# EAGLE design 27128_27256_Multi-ROM_Rev_4 (EAGLE 9.7.0)
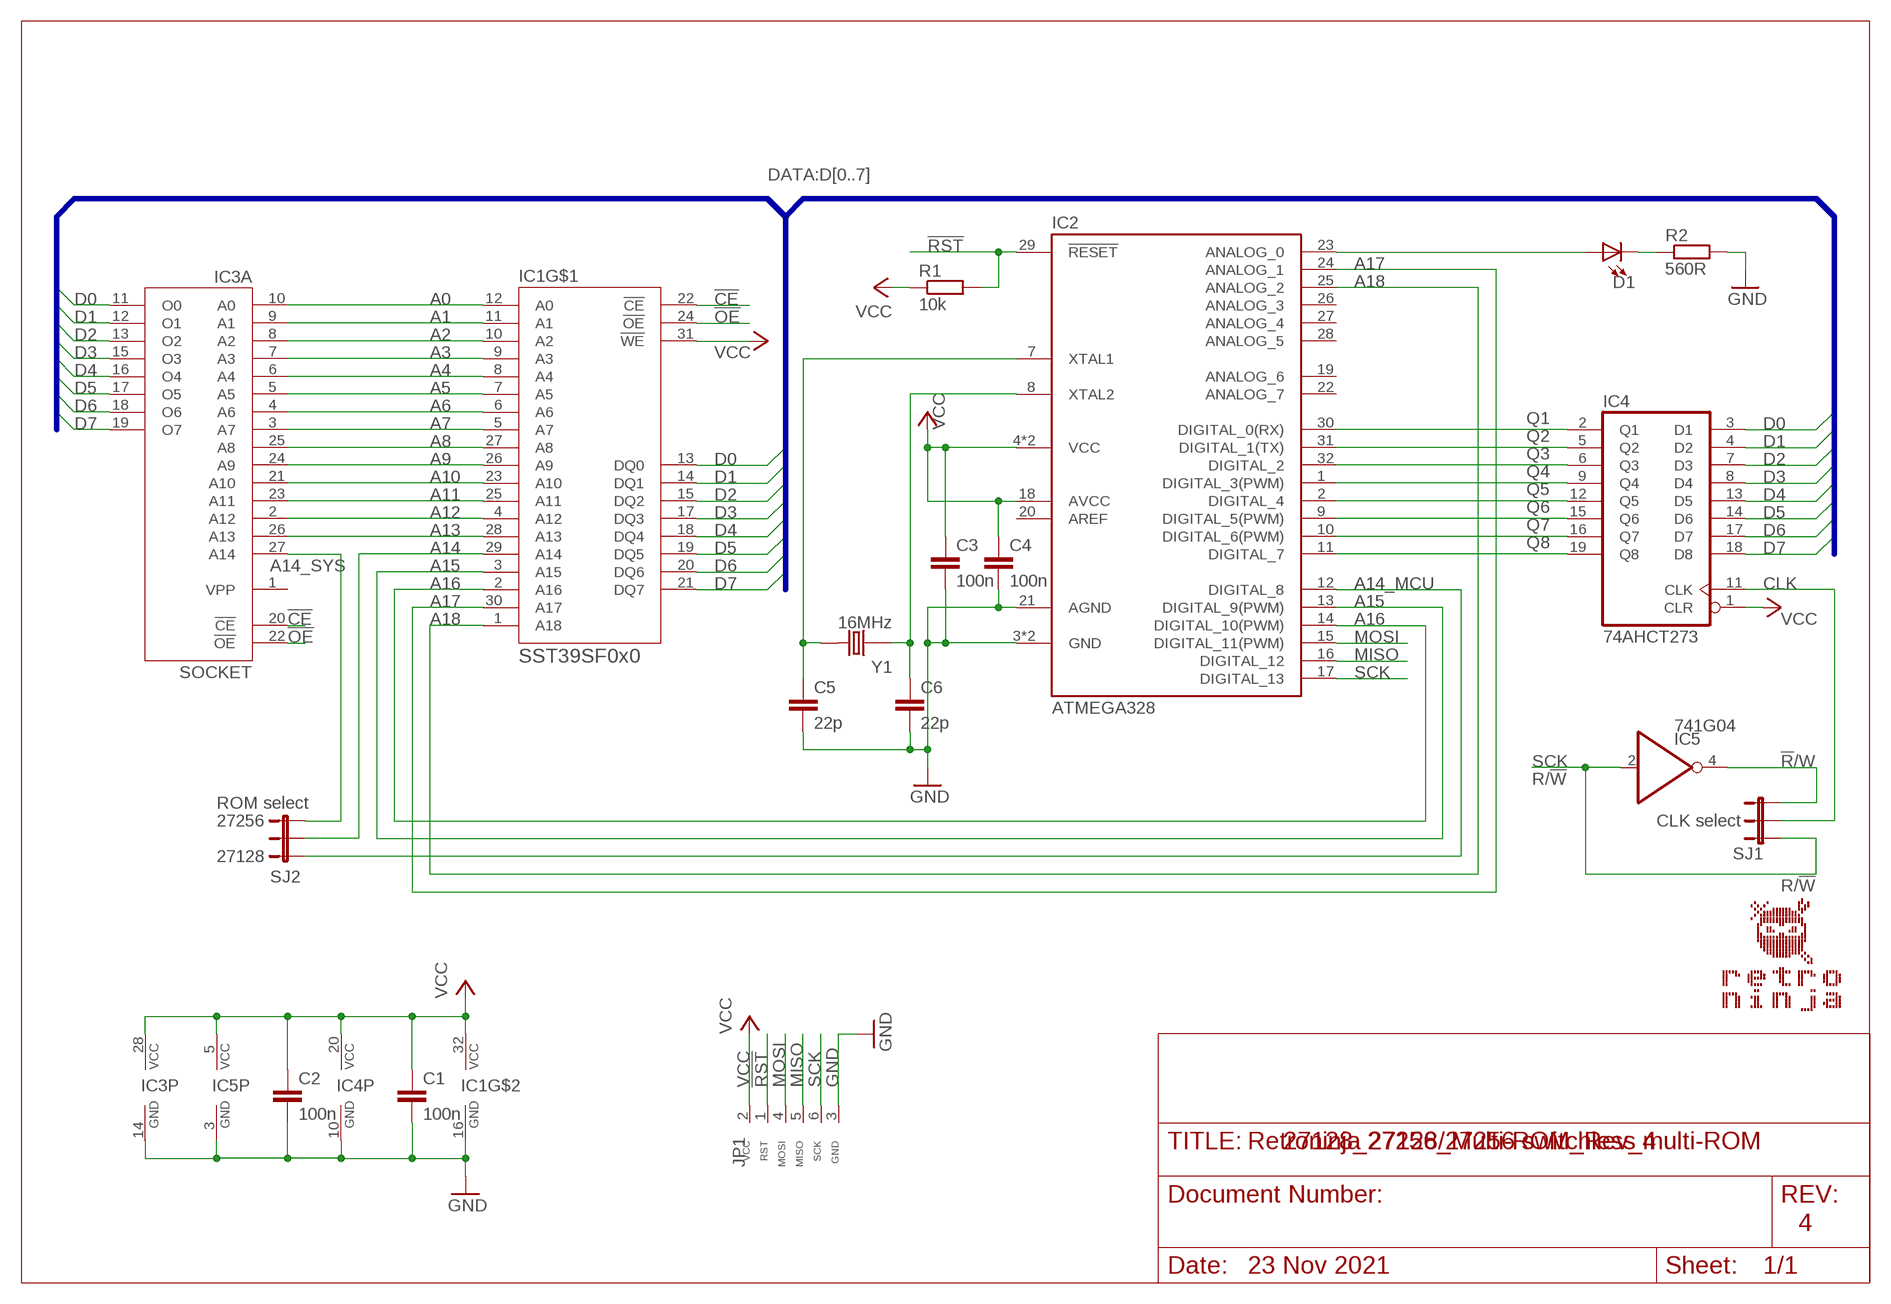
[diagram p0: schematic, sheet 1]

## Parts
C1  100n  C-EUC0805  [C0805]
C2  100n  C-EUC0805  [C0805]
C3  100n  C-EUC0805  [C0805]
C4  100n  C-EUC0805  [C0805]
C5  22p  C-EUC0805  [C0805]
C6  22p  C-EUC0805  [C0805]
D1  LED_0805  [LED0805]
IC1  SST39SF0x0  SST39XX040_PLCC_SHORT  [PLCC32_SHORT]
IC2  ATMEGA328  ARDUINO_168_328_TQFP  [TQFP32]
IC3  SOCKET  27C256_DOWNPINS  [DIL28-6_DOWNPINS]
IC4  74AHCT273  74273NS  [SO20]
IC5  741G04  741G04_SOT23  [SOT23-5]
JP1  ICSP_CONNECTOR_TL866_RIGHT2  [HEADER_1X6_RIGHT]
R1  10k  R-EU_R0805  [R0805]
R2  560R  R-EU_R0805  [R0805]
SJ1  JUMPER-3SJ  [SJ-3]
SJ2  JUMPER-3SJ  [SJ-3]
Y1  16MHz  CRYSTAL  [CRYSTAL_SMD-2_7X4X2.3]

## Nets
!CE: IC1.22(!CE) IC3.20(A:!CE)
!OE: IC1.24(!OE) IC3.22(A:!OE)
!R!/W: IC5.4(O) SJ1.3
!RST: IC2.29(!RESET) JP1.1(RST) R1.2
A0: IC1.12(A0) IC3.10(A:A0)
A1: IC1.11(A1) IC3.9(A:A1)
A2: IC1.10(A2) IC3.8(A:A2)
A3: IC1.9(A3) IC3.7(A:A3)
A4: IC1.8(A4) IC3.6(A:A4)
A5: IC1.7(A5) IC3.5(A:A5)
A6: IC1.6(A6) IC3.4(A:A6)
A7: IC1.5(A7) IC3.3(A:A7)
A8: IC1.27(A8) IC3.25(A:A8)
A9: IC1.26(A9) IC3.24(A:A9)
A10: IC1.23(A10) IC3.21(A:A10)
A11: IC1.25(A11) IC3.23(A:A11)
A12: IC1.4(A12) IC3.2(A:A12)
A13: IC1.28(A13) IC3.26(A:A13)
A14: IC1.29(A14) SJ2.2
A14_MCU: IC2.12(DIGITAL_8) SJ2.1
A14_SYS: IC3.27(A:A14) SJ2.3
A15: IC1.3(A15) IC2.13(DIGITAL_9(PWM))
A16: IC1.2(A16) IC2.14(DIGITAL_10(PWM))
A17: IC1.30(A17) IC2.24(ANALOG_1)
A18: IC1.1(A18) IC2.25(ANALOG_2)
CLK: IC4.11(CLK) SJ1.2
D0: IC1.13(DQ0) IC3.11(A:O0) IC4.3(D1)
D1: IC1.14(DQ1) IC3.12(A:O1) IC4.4(D2)
D2: IC1.15(DQ2) IC3.13(A:O2) IC4.7(D3)
D3: IC1.17(DQ3) IC3.15(A:O3) IC4.8(D4)
D4: IC1.18(DQ4) IC3.16(A:O4) IC4.13(D5)
D5: IC1.19(DQ5) IC3.17(A:O5) IC4.14(D6)
D6: IC1.20(DQ6) IC3.18(A:O6) IC4.17(D7)
D7: IC1.21(DQ7) IC3.19(A:O7) IC4.18(D8)
GND: C1.2 C2.2 C3.2 C4.2 C5.2 C6.2 IC1.16(GND) IC2.3(GND) IC2.5(GND) IC2.21(AGND) IC3.14(P:GND) IC4.10(GND) IC5.3(GND) JP1.3(GND) R2.2
MISO: IC2.16(DIGITAL_12) JP1.5(MISO)
MOSI: IC2.15(DIGITAL_11(PWM)) JP1.4(MOSI)
N$16: C6.1 IC2.8(XTAL2) Y1.1
N$17: C5.1 IC2.7(XTAL1) Y1.2
N$25: D1.A IC2.23(ANALOG_0)
N$26: D1.C R2.1
Q1: IC2.30(DIGITAL_0(RX)) IC4.2(Q1)
Q2: IC2.31(DIGITAL_1(TX)) IC4.5(Q2)
Q3: IC2.32(DIGITAL_2) IC4.6(Q3)
Q4: IC2.1(DIGITAL_3(PWM)) IC4.9(Q4)
Q5: IC2.2(DIGITAL_4) IC4.12(Q5)
Q6: IC2.9(DIGITAL_5(PWM)) IC4.15(Q6)
Q7: IC2.10(DIGITAL_6(PWM)) IC4.16(Q7)
Q8: IC2.11(DIGITAL_7) IC4.19(Q8)
SCK: IC2.17(DIGITAL_13) IC5.2(I) JP1.6(SCK) SJ1.1
VCC: C1.1 C2.1 C3.1 C4.1 IC1.31(!WE) IC1.32(VCC) IC2.4(VCC) IC2.6(VCC) IC2.18(AVCC) IC3.28(P:VCC) IC4.1(CLR) IC4.20(VCC) IC5.5(VCC) JP1.2(VCC) R1.1
Unconnected: IC2.19(ANALOG_6) IC2.20(AREF) IC2.22(ANALOG_7) IC2.26(ANALOG_3) IC2.27(ANALOG_4) IC2.28(ANALOG_5)

## Buses
DATA:D[0..7]

## Notes on the sheet
- R/!W
- ROM select
- 27256 | CLK select
- 27128
- R/!W
- Retroninja 27128/27256 switchless multi-ROM
- 4
- 23 Nov 2021

## Power pins joined to a net without a drawn wire
VPP: IC3.1(A:VPP)

## Library data of the parts
C1-C6 = rcl:C-EU: CAPACITOR, European symbol; SPICEPREFIX: C
D1 = Per (Fusion 360):LED
IC1 = Per (Fusion 360):SST39XX040
IC2 = Per (Fusion 360):ARDUINO_168_328
IC3 = Per (Fusion 360):27C256
IC4 = Per (Fusion 360):74*273
IC5 = Per (Fusion 360):74*1G04
JP1 = Per (Fusion 360):ICSP_CONNECTOR: PIN HEADER
R1 R2 = rcl:R-EU_: RESISTOR, European symbol; SPICEPREFIX: R
SJ1 SJ2 = Per (Fusion 360):JUMPER-3
Y1 = Per (Fusion 360):CRYSTAL

## Board
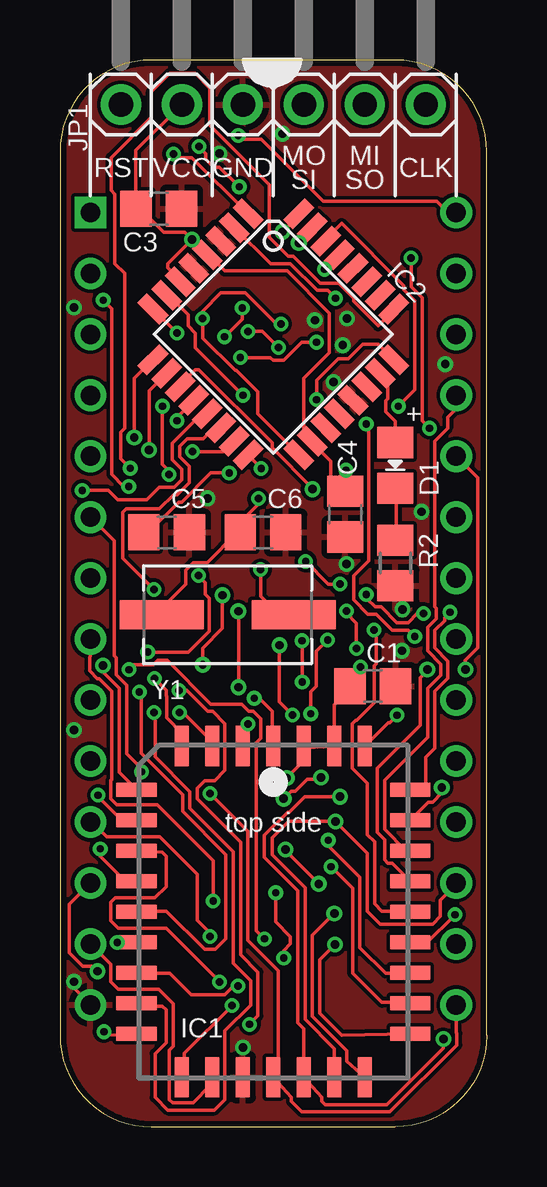
[diagram p1: board, top side]
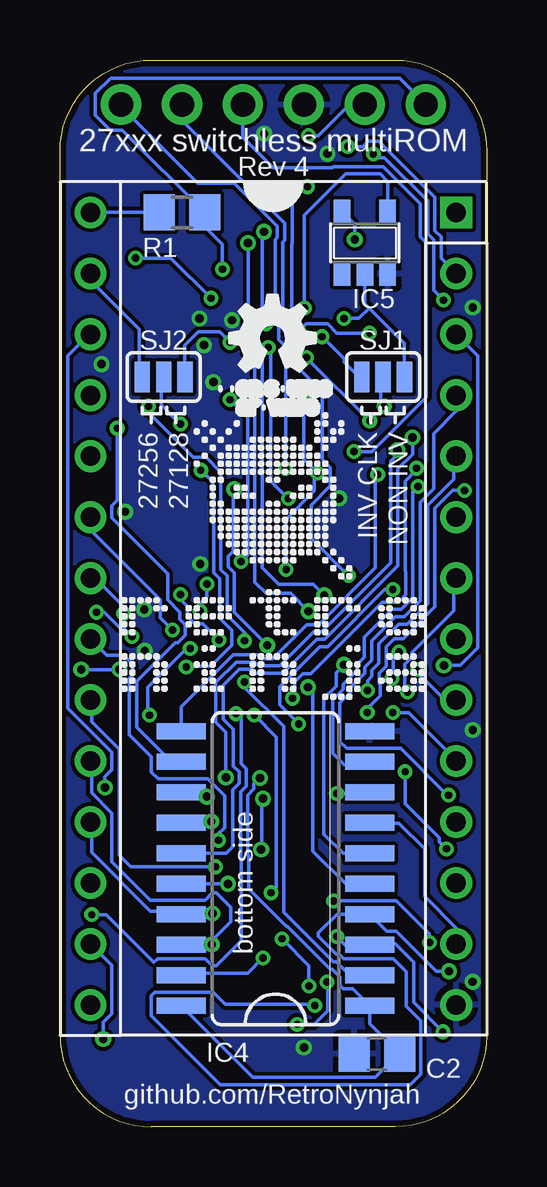
[diagram p2: board, bottom side, seen from below]

Size 17.78 x 44.45 mm. Coordinates in mm from the lower left corner, seen from the top.
Outline: 3.81,0 13.97,0 arc90 17.78,3.81 17.78,40.64 arc90 13.97,44.45 3.81,44.45 arc90 0,40.64 0,3.81 arc90 3.81,0
Copper layers (1*16): Top 0.035mm / dielectric 1.5mm / Bottom 0.035mm
Design rules "SeeedStudio_2layer_DRU_no_angle_20140221": minimum track width 6mil, minimum drill 12mil, track to track 6mil, track to pad 6mil, pad to pad 6mil, via to via 6mil, smd to smd 0mil, copper to edge 10mil, drill to drill 10mil, minimum pad ring 10mil, minimum via ring 6mil, stop-mask expansion 2mil, vias tented up to drill 100mil, thermal gap 10mil

### Footprints (pad centres in the part's own frame; a part is rotated, then mirrored left to right if it is on the bottom)
C0805 = smd 1.3 x 1.5: 1 -0.95,0; 2 0.95,0
LED0805 = smd 1.3 x 1.5: A -0.95,0; C 0.95,0
PLCC32_SHORT = smd 0.584 x 1.676: 1 0,6.9; 2 -1.27,6.9; 3 -2.54,6.9; 4 -3.81,6.9; 14 -3.81,-6.9; 15 -2.54,-6.9; 16 -1.27,-6.9; 17 0,-6.9; 18 1.27,-6.9; 19 2.54,-6.9; 20 3.81,-6.9; 30 3.81,6.9; 31 2.54,6.9; 32 1.27,6.9 | smd 1.676 x 0.584: 5 -5.7,5.08; 6 -5.7,3.81; 7 -5.7,2.54; 8 -5.7,1.27; 9 -5.7,0; 10 -5.7,-1.27; 11 -5.7,-2.54; 12 -5.7,-3.81; 13 -5.7,-5.08; 21 5.7,-5.08; 22 5.7,-3.81; 23 5.7,-2.54; 24 5.7,-1.27; 25 5.7,0; 26 5.7,1.27; 27 5.7,2.54; 28 5.7,3.81; 29 5.7,5.08
TQFP32 = smd 1.27 x 0.559: 1 -4.293,2.8; 2 -4.293,2; 3 -4.293,1.2; 4 -4.293,0.4; 5 -4.293,-0.4; 6 -4.293,-1.2; 7 -4.293,-2; 8 -4.293,-2.8; 17 4.293,-2.8; 18 4.293,-2; 19 4.293,-1.2; 20 4.293,-0.4; 21 4.293,0.4; 22 4.293,1.2; 23 4.293,2; 24 4.293,2.8 | smd 0.559 x 1.27: 9 -2.8,-4.293; 10 -2,-4.293; 11 -1.2,-4.293; 12 -0.4,-4.293; 13 0.4,-4.293; 14 1.2,-4.293; 15 2,-4.293; 16 2.8,-4.293; 25 2.8,4.293; 26 2,4.293; 27 1.2,4.293; 28 0.4,4.293; 29 -0.4,4.293; 30 -1.2,4.293; 31 -2,4.293; 32 -2.8,4.293
DIL28-6_DOWNPINS = drill 0.813 square: 1 -16.51,-7.62 | drill 0.813: 2 -13.97,-7.62; 3 -11.43,-7.62; 4 -8.89,-7.62; 5 -6.35,-7.62; 6 -3.81,-7.62; 7 -1.27,-7.62; 8 1.27,-7.62; 9 3.81,-7.62; 10 6.35,-7.62; 11 8.89,-7.62; 12 11.43,-7.62; 13 13.97,-7.62; 14 16.51,-7.62; 15 16.51,7.62; 16 13.97,7.62; 17 11.43,7.62; 18 8.89,7.62; 19 6.35,7.62; 20 3.81,7.62; 21 1.27,7.62; 22 -1.27,7.62; 23 -3.81,7.62; 24 -6.35,7.62; 25 -8.89,7.62; 26 -11.43,7.62; 27 -13.97,7.62; 28 -16.51,7.62
SO20 = smd 0.66 x 2.032: 1 -5.369,-4.019; 2 -4.099,-4.019; 3 -2.829,-4.019; 4 -1.559,-4.019; 5 -0.289,-4.019; 6 0.981,-4.019; 7 2.251,-4.019; 8 3.521,-4.019; 9 4.791,-4.019; 10 6.061,-4.019; 11 6.061,3.839; 12 4.791,3.839; 13 3.521,3.839; 14 2.251,3.839; 15 0.981,3.839; 16 -0.289,3.839; 17 -1.559,3.839; 18 -2.829,3.839; 19 -4.099,3.839; 20 -5.369,3.839
SOT23-5 = smd 0.69 x 0.99: 1 -0.95,-1.29; 2 0,-1.29; 3 0.95,-1.29; 4 0.95,1.3; 5 -0.95,1.3
HEADER_1X6_RIGHT = drill 1.016 pad 1.676: 1 -6.35,-1.27; 2 -3.81,-1.27; 3 -1.27,-1.27; 4 1.27,-1.27; 5 3.81,-1.27; 6 6.35,-1.27
R0805 = smd 1.3 x 1.5: 1 -0.95,0; 2 0.95,0
SJ-3 = smd 0.635 x 1.27: 1 -0.889,0; 2 0,0; 3 0.889,0
CRYSTAL_SMD-2_7X4X2.3 = smd 3.5 x 1.2: 1 -2.75,0; 2 2.75,0

### Placement (x,y rotation side)
C1  13.03,18.36 0 top
C2  4.57,3.04 180 bottom
C3  4.11,38.25 0 top
C4  11.89,25.53 270 top
C5  4.45,24.77 0 top
C6  8.46,24.77 0 top
D1  13.97,27.56 270 top
IC1  8.89,8.97 0 top
IC2  8.89,33.02 315 top
IC3  8.89,21.59 270 top
IC4  8.89,10.41 90 bottom
IC5  5.08,36.83 0 bottom
JP1  8.89,43.87 0 top
R1  12.7,38.1 0 bottom
R2  13.97,23.5 270 top
SJ1  4.32,31.24 180 bottom
SJ2  13.46,31.24 180 bottom
U$1  [RETRONINJA_12MM]  15.24,17.78 0 bottom
U$2  [OSHW_5MM]  11.3,29.72 0 bottom
Y1  6.99,21.34 0 top

### Tracks (layer width: path | path; a pad name or v marks a point on that pad's centre or on a via)
!CE  (via drill 0.3)
  Top 0.152: IC1.22 14.48,5.18 13.41,5.18 12.19,6.4 12.19,9.94 v11.29,10.84
  Bottom 0.152: IC3.20 16.46,17.68 16.46,16.88 15.32,15.73 15.32,11.32 14.83,10.84 11.35,10.84 v11.29,10.84
!OE  (via drill 0.3)
  Top 0.152: IC1.24 15.24,7.62 v16.46,8.84 | v10.45,17.21 10.45,18.13 10.69,18.36 10.69,19.81 v11.15,20.28 | v12.76,22.18 12.76,22.26 12.78,22.28 12.78,22.01 13.12,21.67 13.38,21.67 14.04,21 14.5,21 14.89,21.39 v15.14,21.39
  Bottom 0.152: v16.46,8.84 15.85,8.84 13.87,6.86 13.72,7.01 11.73,7.01 11.43,6.71 11.28,6.71 10.22,7.76 10.22,11.16 10.26,11.2 10.26,13.95 10.01,14.2 10.01,14.91 10.22,15.12 10.22,16.98 v10.45,17.21 | IC3.22 16.31,22.86 15.14,21.69 v15.14,21.39 | v12.76,22.18 12.76,21.98 12.48,21.69 12.48,21.27 12.16,20.95 11.83,20.95 v11.15,20.28
!R!/W  (via drill 0.3)
  Top 0.152: v7.59,34.11 7.59,33.66 v6.86,32.92
  Bottom 0.152: IC5.4 4.13,39.38 4.45,39.7 5.87,39.7 7.59,37.97 v7.59,34.11 | v6.86,32.92 5.94,32 5.94,31.85 5.49,31.39 5.33,31.39 5.18,31.24 SJ1.3
!RST  (via drill 0.3)
  Top 0.152: IC2.29 11.62,36.34 v11.02,35.73
  Bottom 0.152: JP1.1 3.63,43.69 15.64,43.69 15.71,43.65 16.31,43.06 16.31,42.15 15.68,41.53 15.18,41.53 R1.2 11.73,38.1 11.73,37.49 11.02,36.77 v11.02,35.73
A0  (via drill 0.3)
  Top 0.152: IC1.12 3.2,5.03 4.27,5.03 4.42,4.88 4.42,3.5 3.96,3.05 3.96,1.22 4.49,0.69 6.43,0.69 6.87,1.13 6.87,4 7.94,5.07 7.94,6.09 7.22,6.81 7.22,11.46 5.41,13.27 5.41,13.97 3.96,15.42 3.96,17.21 v3.91,17.26
  Bottom 0.152: IC3.10 1.27,15.28 3.25,17.26 v3.91,17.26
A1  (via drill 0.3)
  Top 0.152: IC1.11 3.2,6.4 4.58,6.4 5.47,5.5 6.87,5.5 7.23,5.87 v7.41,5.87 | v2.88,19.05 3.07,19.24 3.89,19.24 4.08,19.43 4.47,19.43 6.29,17.61 7.58,17.61 7.87,17.32 8.06,17.32 8.37,17.01 8.37,16.18 8.18,16 8.18,8.18 v8.53,7.83
  Bottom 0.152: IC3.9 1.37,17.83 1.79,17.83 2.84,18.88 2.84,19.01 v2.88,19.05 | v7.41,5.87 7.41,6.72 v8.53,7.83
A2  (via drill 0.3)
  Top 0.152: v6.38,9.41 6.38,11.09 4.06,13.41 2.37,13.41 2.12,13.66 2.12,14.43 2.16,14.47 2.16,18.15 1.64,18.67 1.56,18.67 1.23,19 1.23,19.57 1.27,19.61 IC3.8 | v2.39,7.68 2.91,7.68 2.93,7.7 IC1.10
  Bottom 0.152: v6.38,9.41 3.76,9.41 2.39,8.04 v2.39,7.68
A3  (via drill 0.3)
  Top 0.152: IC1.9 3.2,8.99 4.43,8.99 6.03,7.39 6.47,7.39 6.92,7.84 6.92,11.33 5.11,13.14 5.11,13.84 3.38,15.57 3.38,18.04 v3.31,18.11
  Bottom 0.152: IC3.7 1.37,22.86 1.37,21.5 3.12,19.75 3.12,19.56 3.41,19.27 3.41,18.22 v3.31,18.11
A4  (via drill 0.3)
  Top 0.152: v1.68,11.58 1.68,11.28 2.74,10.21 3.05,10.21 IC1.8 | IC3.6 2.26,24.41 2.26,19.62 2.34,19.54 2.34,18.83 2.77,18.4 2.77,15.55 3.4,14.92 v3.4,14.8
  Bottom 0.152: v1.68,11.58 1.98,11.89 1.98,12.04 3.4,13.46 v3.4,14.8
A5  (via drill 0.3)
  Top 0.152: IC1.7 4.27,11.43 4.42,11.28 4.42,10.01 3.94,9.54 2.31,9.54 2.12,9.35 2.12,8.58 2.44,8.27 4.42,8.27 v6.65,6.04 | v7.9,4.27 8.25,4.62 8.25,6.44 7.53,7.16 7.53,11.86 5.71,13.67 5.71,14.12 6.03,14.43 6.44,14.43 6.87,14.86 6.87,16.8 6.36,17.31 6.16,17.31 5.29,18.18 v4.96,18.18
  Bottom 0.152: IC3.5 1.37,27.89 1.37,26.99 2.46,25.89 2.46,21.79 3.31,20.95 3.67,20.95 4.5,20.12 4.5,19.31 4.78,19.02 4.78,18.77 4.96,18.59 v4.96,18.18 | v7.9,4.27 v7.89,4.27 7.19,4.27 6.63,4.83 6.63,6.02 v6.65,6.04
A6  (via drill 0.3)
  Top 0.152: IC1.6 3.05,12.8 2.55,12.8 1.68,13.68 1.68,13.73 v1.59,13.82
  Bottom 0.152: IC3.4 1.22,30.48 1.22,29.87 2.21,28.88 2.21,26.58 2.77,26.02 2.77,21.92 3.44,21.25 3.81,21.25 4.8,20.26 4.8,19.43 5.09,19.15 5.09,18.89 5.67,18.31 5.67,18.11 6.12,17.66 6.12,16.05 5.83,15.76 3.59,15.76 1.64,13.82 v1.59,13.82
A7  (via drill 0.35)
  Top 0.152: IC1.5 2.46,14.77 2.46,18.27 1.79,18.95 v1.79,19.23
  Bottom 0.152: IC3.3 0.38,32.13 0.38,19.95 1.11,19.23 v1.79,19.23
A8
  Top 0.152: IC3.25 16.46,30.48 16.46,29.87 16.15,29.57 16.15,29.11 15.62,28.57 15.62,21.67 15.67,21.61 15.67,21.17 15.32,20.81 15.32,19.83 15.86,19.28 15.86,18.82 15.32,18.27 15.32,16.23 13.52,14.43 13.52,12.39 14.41,11.51 IC1.27
A9  (via drill 0.35)
  Top 0.152: IC1.26 13.84,10.99 13.66,10.99 13.52,11.12 13.52,11.96 13.22,12.26 13.22,14.93 15.01,16.72 15.01,18.72 15.3,19.01 v15.3,19.05 | v16.89,19.05 16.89,19.45 17.4,19.95 17.4,27.05 IC3.24
  Bottom 0.152: v15.3,19.05 v16.89,19.05
A10  (via drill 0.3)
  Top 0.152: IC1.23 14.48,6.4 13.56,6.4 12.5,7.47 12.5,10.39 11.18,11.71 v11.18,11.94
  Bottom 0.152: v11.18,11.94 11.18,12.22 10.92,12.47 10.92,13.8 11.62,14.49 13.69,14.49 13.97,14.78 13.97,15.43 14.88,16.34 14.88,18.68 14.75,18.82 14.75,19.28 15.12,19.65 15.84,19.65 IC3.21
A11  (via drill 0.3)
  Top 0.152: IC1.25 14.48,8.99 13.41,8.99 13.11,9.3 13.11,11.87 12.8,12.17 12.8,14.31 12.18,14.93 12.18,16.8 12.31,16.93 12.37,16.93 13.1,17.66 13.1,19.21 13.19,19.29 13.19,20.6 v13.09,20.7
  Bottom 0.152: IC3.23 16.46,25.3 16.46,24.82 13.6,21.96 13.6,21.21 v13.09,20.7
A12  (via drill 0.3)
  Top 0.152: v5.79,40.84 6.08,40.55 6.08,40.32 6.41,39.99 6.64,39.99 v7.47,39.17 | IC1.4 5.08,16.41 4.45,17.04 4.45,17.95 4.43,17.96 4.43,18.19 v3.94,18.68 | v3.66,19.78 5.35,19.78 6.21,20.64 6.21,22.03 6.06,22.18 6.06,22.68 v5.77,22.97
  Bottom 0.152: v5.79,40.84 5.17,40.84 4.95,41.07 4.5,41.07 2.16,38.73 2.16,37.34 1.91,37.09 1.91,36.2 IC3.2 | v7.47,39.17 7.59,39.17 8.11,38.64 8.11,36.81 8.13,36.79 8.13,33.6 8.37,33.36 8.37,32.92 8.05,32.6 8.05,31.82 6.86,30.63 6.86,27.8 6.52,27.46 6.52,26.71 7.32,25.91 7.32,24.52 v5.77,22.97 | v3.66,19.78 3.89,19.55 3.89,19.03 3.94,18.97 v3.94,18.68
A13  (via drill 0.35)
  Top 0.152: IC1.28 15.34,13.53 15.52,13.53 15.91,13.91 v15.91,14.14
  Bottom 0.152: v15.91,14.14 15.91,14.59 15.62,14.87 15.62,15.61 17.45,17.44 17.45,32.13 16.56,33.02 IC3.26
A14  (via drill 0.3)
  Top 0.152: IC1.29 14.63,14.02 14.94,14.02 15.24,14.33 15.24,15.39 15.62,15.77 15.62,18.15 16.17,18.69 16.17,19.41 15.62,19.95 15.62,20.69 16.03,21.09 16.03,21.21 v16.26,21.44 | v12.76,29.28 12.87,29.18 12.87,23.59 12.23,22.95 12.23,21.95 12.82,21.36 13.18,21.36 13.84,20.7 14.5,20.7 v14.78,20.42
  Bottom 0.152: SJ2.2 13.56,31.24 13.56,30.08 v12.76,29.28 | v14.78,20.42 15.17,20.81 15.31,20.81 15.94,21.44 v16.26,21.44
A14_MCU  (via drill 0.3)
  Top 0.152: IC2.12 5.49,30.18 4.88,29.57 v4.88,29.42 v4.87,29.42 | v7.51,32.05 8.77,32.05 8.88,31.94 9.32,31.94 10.08,32.69 v10.69,32.69
  Bottom 0.152: SJ2.1 12.57,32.56 12.01,33.12 11.13,33.12 v10.69,32.69 | v4.87,29.42 4.88,29.42 v7.51,32.05
A14_SYS
  Bottom 0.152: SJ2.3 14.48,31.24 14.48,33.22 16.46,35.2 16.46,35.51 IC3.27
A15  (via drill 0.3)
  Top 0.152: IC1.3 6.25,15.85 6.25,16.15 5.14,17.26 v4.98,17.26 | v0.93,26.52 2.01,26.52 2.41,26.12 3.61,26.12 4.14,26.64 4.76,26.64 5.08,26.95 5.08,27.4 4.69,27.78 4.69,28.48 5.91,29.7 IC2.13
  Bottom 0.152: v0.93,26.52 1.41,26.52 2.16,25.77 2.16,21.67 3.48,20.34 3.84,20.34 4.19,20 4.19,19.18 4.48,18.9 4.48,18.45 4.43,18.41 4.43,17.96 4.98,17.41 v4.98,17.26
A16  (via drill 0.3)
  Top 0.152: IC2.14 6.44,29.14 5.96,28.66 5.3,28.66 4.99,28.35 4.99,27.91 5.38,27.52 5.38,26.83 4.89,26.34 4.74,26.34 4.14,25.74 2.75,25.74 2.62,25.61 2.62,23.69 v3.91,22.39 | IC1.2 7.84,16.08 v7.84,16.79
  Bottom 0.152: v3.91,22.39 4.25,22.39 6.63,20.01 6.96,20.01 8.63,18.35 8.63,17.58 v7.84,16.79
A17  (via drill 0.3)
  Top 0.152: IC2.24 13.87,32 13.26,32.61 12.61,32.61 12.01,32.01 11.59,32.01 10.69,31.12 v10.69,30.3 | IC1.30 13.67,16.84 13.74,16.84 v14.05,17.15 | v11.94,21.49 11.94,21.39 12.35,20.98 v12.35,19.92 | v11.66,22.61 11.18,22.61 v10.24,23.56
  Bottom 0.152: v14.05,17.15 14.12,17.23 14.12,18.31 12.51,19.92 v12.35,19.92 | v11.94,21.49 11.94,21.8 11.66,22.09 v11.66,22.61 | v10.69,30.3 9.96,29.57 9.96,23.83 v10.24,23.56
A18  (via drill 0.3)
  Top 0.152: IC2.25 13.87,33.98 13.26,33.38 12.23,34.4 12.23,34.53 11.61,35.15 10.84,35.15 9.72,36.27 9.51,36.27 8.72,37.06 8.72,39.25 6.25,41.72 6.25,43.28 5.64,43.89 4.57,43.89 3.81,43.13 3.81,42.06 2.13,40.39 2.13,39.01 2.29,38.86 2.29,35.97 2.69,35.56 2.69,29.11 2.54,28.95 2.54,27.83 v2.93,27.44 | IC1.1 8.84,15.85 8.84,17.32 8.31,17.86 v8.09,17.86
  Bottom 0.152: v8.09,17.86 8,17.95 8,18.54 7.67,18.87 7.34,18.87 4.35,21.86 3.69,21.86 3.38,22.17 3.38,23.12 3.4,23.14 3.4,26.9 2.93,27.37 v2.93,27.44
CLK  (via drill 0.3)
  Top 0.152: v4.27,30.02 4.27,28.43 4.27,27.61 4.54,27.34 v4.54,27.18
  Bottom 0.152: v4.27,30.02 4.42,30.18 4.42,31.24 SJ1.2 | IC4.11 12.73,17.51 10.57,19.67 9.54,19.67 9.37,19.51 8.91,19.51 7.5,20.93 7.01,20.93 4.65,23.29 4.65,27.07 v4.54,27.18
D0  (via drill 0.3)
  Top 0.152: IC1.13 1.98,3.81 v1.83,3.96 | IC3.11 1.37,12.65 1.94,12.08 4.16,12.08 5.71,10.52 5.71,8.61 6.25,8.08 v6.25,7.92
  Bottom 0.152: v1.83,3.96 3.05,5.18 3.05,6.86 3.81,7.62 4.72,7.62 IC4.3 4.88,7.47 5.79,7.47 v6.25,7.92
D1  (via drill 0.3, 0.35)
  Top 0.152: IC1.14 5.18,2.13 5.18,3.06 v7.17,5.05 | IC3.12 0.38,9.27 0.38,7.25 0.95,6.68 1.36,6.68 v1.57,6.48
  Bottom 0.152: v1.57,6.48 2.1,6.48 3.76,8.14 4.16,8.14 IC4.4 6.23,8.86 7.01,8.08 7.01,7.93 6.26,7.18 6.14,7.18 5.97,7.01 3.9,7.01 3.35,6.47 3.35,5.03 2.74,4.42 2.74,2.19 3.18,1.75 11.11,1.75 13.97,4.62 13.97,5.47 13.84,5.6 11.39,5.6 10.89,5.1 7.22,5.1 v7.17,5.05
D2
  Top 0.152: IC1.15 6.25,1.98 6.25,1.71 5.54,1 4.69,1 4.56,1.13 4.56,3.19 4.72,3.35 4.72,5.13 4.12,5.73 2.44,5.73 2.12,6.04 2.12,6.77 IC3.13
  Bottom 0.152: IC4.7 4.72,12.65 3.66,12.65 2.59,11.58 2.59,9.6 1.22,8.23 1.22,7.62 IC3.13
D3  (via drill 0.3)
  Top 0.152: IC3.15 16.51,3.91 16.53,3.89 16.53,3.4 13.75,0.62 10.08,0.62 9.64,1.06 9.64,1.24 IC1.17 9.09,2.27 9.09,6.51 7.83,7.77 7.83,12.31 v6.25,13.89
  Bottom 0.152: IC4.8 4.88,13.87 6.22,13.87 v6.25,13.89
D4  (via drill 0.35)
  Top 0.152: v15.98,3.66 15.98,3.28 13.62,0.92 11.04,0.92 10.91,1.06 10.91,1.24 IC1.18 10.16,4.09 9.91,4.35 9.91,9.83 8.51,11.23 8.51,12.14 9.49,13.12 9.55,13.12 10.19,13.76 v11.67,13.76
  Bottom 0.152: v15.98,3.66 15.98,4.36 15.62,4.71 15.62,6.73 IC3.16 | v11.67,13.76 11.85,13.94 IC4.13
D5  (via drill 0.35)
  Top 0.152: IC1.19 11.43,3.25 10.21,4.47 10.21,9.96 8.84,11.33 8.84,12.04 9.53,12.72 v11.47,12.72 v11.48,12.72 12.8,11.4 12.8,8.99 13.35,8.45 15.52,8.45 15.85,8.77 15.85,9.45 16.46,10.06 IC3.17
  Bottom 0.152: v11.48,12.72 11.54,12.66 IC4.14
D6  (via drill 0.35)
  Top 0.152: IC1.20 11.95,2.74 11.95,3.16 10.52,4.6 10.52,7.98 v11.43,8.89
  Bottom 0.152: v11.43,8.89 12.69,8.89 IC4.17 12.8,8.99 14.02,8.99 16.46,11.43 16.46,12.65 IC3.18
D7  (via drill 0.35)
  Top 0.152: v11.46,7.59 10.82,6.96 10.82,4.72 11.73,3.81 IC1.21
  Bottom 0.152: IC4.18 v11.46,7.58 v11.46,7.59 11.58,7.62 10.67,8.53 10.67,9.14 11.28,9.75 11.43,9.75 11.73,9.45 14.02,9.45 15.62,11.05 15.62,13.07 16.46,13.91 16.46,15.19 IC3.19
GND  (via drill 0.35)
  Top 0.152: IC3.14 0.58,5.77 v0.58,6.04 | R2.2 14.27,22.25 v14.27,21.56
  other vias: 7.62,3.31 11.39,31.03 6.15,26.19 14.25,19.84 0.58,16.54 6.64,40.55 9.27,41.38 11.94,23.45 0.58,34.14 16.05,31.78 10.62,33.6 11.78,32.57 11.96,33.68 15.06,25.63
  pour Top: 3.81,0.08 13.97,0.08 14.5,0.11 15.02,0.23 15.52,0.41 15.99,0.67 16.41,0.99 16.79,1.37 17.11,1.79 17.37,2.26 17.55,2.76 17.67,3.28 17.7,3.81 17.7,40.64 17.67,41.17 17.55,41.69 17.37,42.19 17.11,42.66 16.79,43.08 16.41,43.46 15.99,43.78 15.52,44.04 15.02,44.22 14.5,44.34 13.97,44.37 3.81,44.37 3.28,44.34 2.76,44.22 2.26,44.04 1.79,43.78 1.37,43.46 0.99,43.08 0.67,42.66 0.41,42.19 0.23,41.69 0.11,41.17 0.08,40.64 0.08,3.81 0.11,3.28 0.23,2.76 0.41,2.26 0.67,1.79 0.99,1.37 1.37,0.99 1.79,0.67 2.26,0.41 2.76,0.23 3.28,0.11
  pour Bottom: 3.81,0.08 13.97,0.08 14.5,0.11 15.02,0.23 15.52,0.41 15.99,0.67 16.41,0.99 16.79,1.37 17.11,1.79 17.37,2.26 17.55,2.76 17.67,3.28 17.7,3.81 17.7,40.64 17.67,41.17 17.55,41.69 17.37,42.19 17.11,42.66 16.79,43.08 16.41,43.46 15.99,43.78 15.52,44.04 15.02,44.22 14.5,44.34 13.97,44.37 3.81,44.37 3.28,44.34 2.76,44.22 2.26,44.04 1.79,43.78 1.37,43.46 0.99,43.08 0.67,42.66 0.41,42.19 0.23,41.69 0.11,41.17 0.08,40.64 0.08,3.81 0.11,3.28 0.23,2.76 0.41,2.26 0.67,1.79 0.99,1.37 1.37,0.99 1.79,0.67 2.26,0.41 2.76,0.23 3.28,0.11
MISO  (via drill 0.3)
  Top 0.152: v8.38,27.43 7.92,27.89 IC2.16
  Bottom 0.152: JP1.5 12.65,42.52 12.65,41.88 8.42,37.65 8.42,36.94 8.5,36.85 8.5,33.66 8.67,33.48 8.67,32.79 8.38,32.5 v8.38,27.43
MOSI  (via drill 0.3)
  Top 0.152: IC2.15 7.16,28.5 6.79,28.13 v5.53,28.13
  Bottom 0.152: JP1.4 10.16,41.22 8.89,39.96 6.44,39.96 6.39,40.01 4.32,40.01 2.77,38.45 2.77,37.09 2.52,36.84 2.52,30.4 4.78,28.13 v5.53,28.13
N$16  (via drill 0.3)
  Top 0.152: v4.88,33.07 3.96,33.98 IC2.8 | Y1.1 4.24,21.61 5.23,22.61 5.23,23.19 5.54,23.5 6.13,23.5 7.39,24.77 C6.1 7.77,24.84 7.77,25.45 8.27,25.94 v8.27,26.18 | v9.1,32.47 8.44,33.14 v7.83,33.14
  Bottom 0.152: v4.88,33.07 6.25,33.07 6.63,33.45 7.52,33.45 v7.83,33.14 | v8.27,26.18 8.99,26.9 8.99,32.36 v9.1,32.47
N$17  (via drill 0.3)
  Top 0.152: v7.62,30.48 5.64,32.46 5.64,33.07 5.33,33.38 5.33,33.83 4.57,34.59 IC2.7 | C5.1 3.81,24.84 3.81,24.9 4.94,26.03 5.07,26.03 6.28,27.24 v7.05,27.24 | Y1.2 9.12,21.34 8.36,22.1 v8.36,23.22
  Bottom 0.152: v7.62,30.48 7.62,27.81 7.19,27.38 | v8.36,23.22 8.36,25.32 7.19,26.49 7.19,27.38 | v7.05,27.24 7.19,27.38
N$25
  Top 0.152: D1.A 13.97,29.39 13.56,29.8 13.56,30.24 13.65,30.33 13.65,31.09 IC2.23
N$26
  Top 0.152: R2.1 14.02,24.54 14.02,26.36 D1.C
Q1  (via drill 0.3)
  Top 0.152: IC2.30 11.12,37.03 11.73,37.64 14.33,35.05 14.33,34.88 14.78,34.42 14.78,30.71 v14.1,30.02 | v10.1,18.53 v10.1,20.25 v10.09,20.25
  Bottom 0.152: IC4.2 4.88,6.4 5.79,6.4 6.26,6.88 6.39,6.88 8.46,8.95 8.46,16.69 10.1,18.32 v10.1,18.53 | v10.09,20.25 10.09,20.58 10.82,21.31 10.82,22.96 11.07,23.21 11.07,27.27 11.69,27.89 12.22,27.89 14.1,29.76 v14.1,30.02
Q2  (via drill 0.35)
  Top 0.152: IC2.31 10.51,37.24 10.1,36.83 v9.95,36.83 | v7.44,18.31 7.44,21.47 v7.43,21.48
  Bottom 0.152: IC4.5 5.88,10.12 7.24,11.48 7.24,18.11 v7.44,18.31 | v7.43,21.48 8.17,22.23 9.2,22.23 9.66,22.69 9.66,31.84 10.04,32.22 10.04,33.8 9.95,33.9 9.95,36.66 v9.95,36.83
Q3  (via drill 0.35)
  Top 0.152: v5.95,19.25 5.95,19.94 6.77,20.77 v6.77,22.15 | IC2.32 9.95,37.96 v9.28,37.29
  Bottom 0.152: IC4.6 5.98,11.39 6.78,12.2 6.78,17.86 6.28,18.36 6.28,18.92 v5.95,19.25 | v6.77,22.15 7.23,22.61 8.66,22.61 9.35,23.29 9.35,31.96 9.74,32.35 9.74,33.67 9.36,34.05 9.36,37.21 v9.28,37.29
Q4  (via drill 0.3)
  Top 0.152: IC2.1 7.77,38.1 5.49,40.39 4.88,40.39 v4.72,40.54 | v2.87,26.68 2.66,26.68 2.16,27.18 2.16,34.09 v1.8,34.44
  Bottom 0.152: IC4.9 4.88,15.09 5.94,15.09 6.41,15.56 6.41,15.92 6.42,15.92 6.42,17.79 5.97,18.24 5.97,18.44 5.39,19.02 5.39,19.28 5.11,19.57 5.11,20.4 3.95,21.55 3.56,21.55 3.07,22.05 3.07,26.47 v2.87,26.68 | v4.72,40.54 4.57,40.39 4.27,40.39 2.46,38.58 2.46,37.22 2.21,36.97 2.21,34.85 v1.8,34.44
Q5  (via drill 0.3)
  Top 0.152: v11.48,34.52 11.16,34.85 10.71,34.85 9.59,35.97 8.77,35.97 IC2.2 | v14.63,36.2 14.63,35 15.09,34.55 15.09,29.42 v15.39,29.11
  Bottom 0.152: v14.63,36.2 13.16,36.2 v11.48,34.52 | IC4.12 12.8,15.09 13.01,15.09 14.58,16.66 14.58,18.56 12.98,20.16 12.87,20.16 12.56,20.47 12.56,20.92 12.78,21.14 12.78,21.44 13.3,21.95 13.3,23.05 15.62,25.38 15.62,25.88 15.39,26.11 v15.39,29.11
Q6  (via drill 0.35)
  Top 0.152: IC2.9 3.09,31.18 v3.09,28.72
  Bottom 0.152: IC4.15 10.86,11.39 10.59,11.66 10.59,14.05 10.31,14.32 10.31,14.79 10.56,15.03 10.56,16.57 10.98,16.99 10.98,18.4 10.32,19.06 9.79,19.06 9.63,18.9 8.5,18.9 7.09,20.32 6.75,20.32 3.7,23.37 3.7,27.42 3.09,28.03 v3.09,28.72
Q7  (via drill 0.35)
  Top 0.152: v10.87,14.55 10.79,14.47 10.3,14.47 9.81,13.98 9.63,13.98 v9.32,13.67 | v3.71,28.2 3.71,30.67 IC2.10 | v10.78,10.12 9.4,11.51 v9.4,11.56
  Bottom 0.152: IC4.16 v10.78,10.12 | v9.32,13.67 9.32,13.66 9.37,13.6 9.37,11.58 v9.4,11.56 | v10.87,14.55 10.87,16.43 11.29,16.85 11.29,18.52 10.44,19.37 9.66,19.37 9.5,19.2 8.63,19.2 7.21,20.62 6.88,20.62 4.01,23.5 4.01,27.73 3.71,28.02 v3.71,28.2
Q8  (via drill 0.3, 0.35)
  Top 0.152: IC2.11 5.03,30.94 5.64,31.55 5.79,31.55 8.84,28.5 8.84,28.29 10.52,26.61 v10.52,26.57 | v8.99,9.75 8.99,8.53 9.6,7.92 9.6,7.62 9.32,7.34 v9.32,7.04 | v9.69,17.16 9.14,17.7 v9.14,20.07
  Bottom 0.152: IC4.19 12.65,6.4 9.96,6.4 v9.32,7.04 | v8.99,9.75 8.76,9.98 8.76,16.24 v9.69,17.16 | v9.14,20.07 10.52,21.44 10.52,23.08 10.77,23.34 10.77,23.78 10.56,23.98 10.56,26.52 v10.52,26.57
SCK  (via drill 0.3)
  Top 0.152: IC2.17 9.91,28.04 8.23,29.72 8.23,30.62 7.34,31.52 7.29,31.52 5.94,32.87 v5.94,33.68 5.94,33.98 6.71,34.75 7.71,34.75 9.01,33.45 v9.2,33.45
  Bottom 0.152: SJ1.1 3.43,32.64 4.9,34.11 | 4.9,34.11 5.08,34.29 IC5.2 | v5.94,33.68 5.33,33.68 4.9,34.11 | JP1.6 15.24,42.52 12.04,39.32 10.52,39.32 8.72,37.52 8.72,37.06 8.81,36.97 8.81,33.84 v9.2,33.45
VCC  (via drill 0.3, 0.35)
  Top 0.152: JP1.2 3.17,40.68 C3.1 3.34,38.25 4.32,37.27 5.2,37.27 v5.5,36.97 | IC2.6 5.01,35.28 4.5,35.79 4.5,35.97 v5.5,36.97 | v5.5,36.97 IC2.4 6.25,36.27 6.86,35.66 9.47,35.66 11.23,33.9 11.23,32.26 10.16,31.19 10.16,29.01 10.36,28.8 10.36,28.65 IC2.18 10.52,28.5 11.28,27.74 11.28,26.98 11.4,26.85 | 10.21,15.79 IC1.32 | 10.21,15.79 IC1.31 11.43,17.58 12.08,18.23 C1.1 12.08,18.73 v12.52,19.16 | 11.43,26.82 11.73,26.52 C4.1 11.43,26.82 | 11.43,26.82 11.4,26.85 | IC3.28 16.15,38.1 15.7,38.56 10.97,38.56 8.38,41.15 7.58,41.15 v7.42,41.3 | v11.91,27.36 11.4,26.85 | 10.21,15.79 9.97,15.55 9.97,15.06 v9.45,14.54
  Bottom 0.152: R1.1 IC3.28 | v5.5,36.97 5.5,37.6 IC5.5 | 3.65,3.06 4.87,4.29 IC4.1 5.58,5.76 5.98,5.76 6.12,5.89 6.12,6.26 6.43,6.57 6.51,6.57 8.3,8.37 8.36,8.37 9.91,9.91 9.91,11.28 9.95,11.33 9.95,13.82 9.7,14.08 9.7,14.29 v9.45,14.54 | 3.65,3.06 C2.1 | IC4.20 9.74,2.06 4.65,2.06 3.65,3.06 | JP1.2 5.18,42.52 5.79,42.52 7.01,41.3 v7.42,41.3 | v11.91,27.36 11.42,26.87 11.42,26.21 11.38,26.17 11.38,23.08 11.12,22.83 11.12,21.18 10.62,20.68 10.62,20.06 11.49,19.18 12.5,19.18 v12.52,19.16

### Text on the board
tPlace: RST | VCC | GND | MO / SI | MI / SO | CLK | + | top side
bPlace: 27xxx switchless multiROM | Rev 4 | NON INV | INV CLK | 27128 | 27256 | bottom side | github.com/RetroNynjah